# Altium schematic sheet LCD.SchDoc: 20x4 Characters LCD
size A4
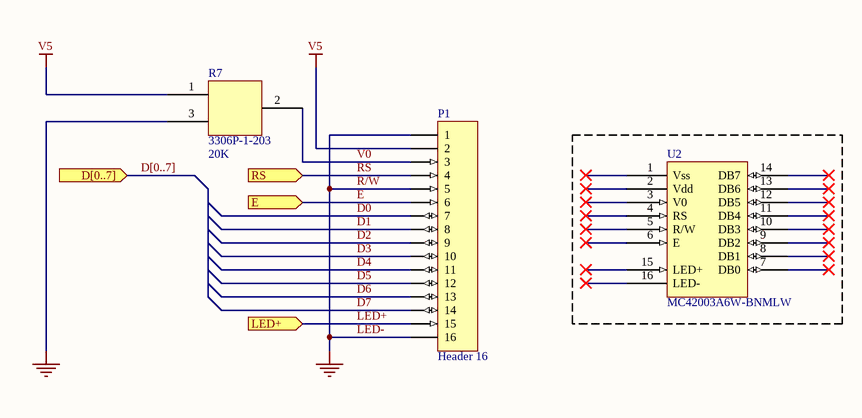
[diagram p0: LCD.SchDoc]

## Parts
P1  Header 16  [Header 16]
R7  3306P-1-203  value 20K  [3306P-1-202]
U2  MC42003A6W-BNMLW  [MC42004A6W-BNMLW]  (mechanical)

## Ports
D[0..7] (in), E (in), LED+ (in), RS (in)

## Nets
LED-: P1.1 P1.5 P1.16 R7.3  [also labelled GND, R/W]
V5: P1.2 R7.1
D0: P1.7
D1: P1.8
D2: P1.9
D3: P1.10
D4: P1.11
D5: P1.12
D6: P1.13
D7: P1.14
E: P1.6 ; port E
LED+: P1.15 ; port LED+
RS: P1.4 ; port RS
V0: P1.3 R7.2

Not connected (* = marked no-connect by the designer): U2 1(Vss)* 2(Vdd)* 3(V0)* 4(RS)* 5(R/W)* 6(E)* 7(DB0)* 8(DB1)* 9(DB2)* 10(DB3)* 11(DB4)* 12(DB5)* 13(DB6)* 14(DB7)* 15(LED+)* 16(LED-)*

## Buses and harness runs
bus D[0..7] = port D[0..7]

## Notes on the sheet
- Title
- Size:
- Date:
- A4
- Number:
- Time:
- Revision:
- Sheet
- of
- File:

## Library data of the parts
P1 = Header 16: Header, 16-Pin; Fabricant: SAMTEC; Fournisseur: Farnell; RefFabricant: CES-116-01-T-S; RefFournisseur: 1667522
R7 = 3306P-1-202: Trimpot; RefFournisseur: 108240; Fabricant: Bourns; Fournisseur: Farnell; RefFabricant: 3306P-1-203
U2 = MC42003A6W-BNMLW: LCD; Fabricant: MIDAS; Fournisseur: Farnell; RefFournisseur: 2063162; RefFabricant: MC42004A6W-BNMLW